# Altium schematic sheet NCP718_Breakout.SchDoc
size A4; SheetNumber: 1; SheetTotal: 1
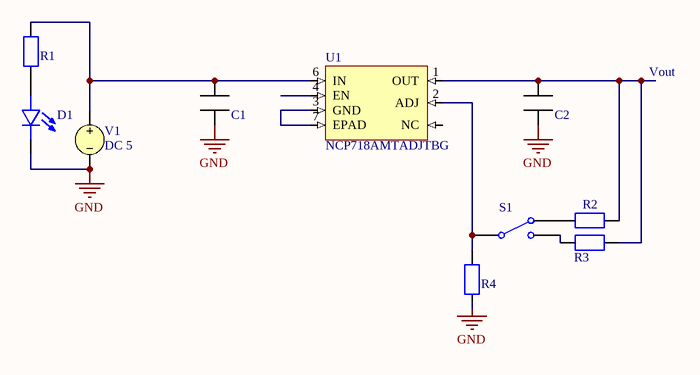
[diagram p0: NCP718_Breakout.SchDoc]

## Parts
C1  CAP_0805  [RES_0805]  (value not drawn)
C2  CAP_0805  [RES_0805]  (value not drawn)
D1  LED_0805  [RES_0805]  (value not drawn)
R1  RES_0805  [RES_0805]  (value not drawn)
R2  RES_0805  [RES_0805]  (value not drawn)
R3  RES_0805  [RES_0805]  (value not drawn)
R4  RES_0805  [RES_0805]  (value not drawn)
S1  Single-Pole, Double-Throw Switch  (value not drawn)
U1  NCP718AMTADJTBG  [FP-511BR-MFG]
V1  DC 5

## Nets
GND: C1.6 C2.6 D1.2(C) R4.1 V1.2
NetC1_7: C1.7 R1.1 U1.6(IN) V1.1
NetC2_7: C2.7 R2.2 R3.2 U1.1(OUT)
NetD1_1: D1.1(A) R1.2
NetR2_1: R2.1 S1.3
NetR3_1: R3.1 S1.2
NetR4_2: R4.2 S1.1 U1.2(ADJ)
NetU1_3: U1.3(GND) U1.7(EPAD)

Not connected (* = marked no-connect by the designer): U1 4(EN) 5(NC)

## Notes on the sheet
- Vout

## Library data of the parts
C1 C2 = CAP_0805: Generic CAP_0805
D1 = LED_0805: LED; SMD;; MF: Kingbright; MP: KP-1608SURCK; SnapEDA_Link: https://www.snapeda.com/parts/KP-1608SURCK/Kingbright/view-part/?ref=snap; Package: 0603 Kingbright; Value: *; Check_prices: https://www.snapeda.com/parts/KP-1608SURCK/Kingbright/view-part/?ref=eda
R1-R4 = RES_0805: Resistor SMD 0805 Generic; Manufacturer: *; Manufacturer Part Number: *; Tolerance: *; Package Size: *; LCSC Part Number: *
S1 = SPDT SW: nodeUP_closed: 1; Rclosed: 1m; Ropen: 1Meg; SimulationGenericComponent: True
U1 = NCP718AMTADJTBG: LDO Regulator, 300 mA, Wide Vin, Ultra-Low Iq Adjustable, Active Discharge, WDFN6; Manufacturer: onsemi; Accuracy: 2%; Dropout Voltage: 490mV; Max Junction Temperature (Tj): 125°C; Max Supply Voltage: 24V; Min Supply Voltage: 2.5V; Nominal Supply Current: 4µA; Number of Channels: 1; Output Current: 300mA; Supplier: DigiKey; RoHS: Compliant; Category: LDO Voltage Regulators; Stock: 7623; Pricing: 1=1,45, 10=0,891, 25=0,7444, 100=0,5783, 250=0,49668, 500=0,44646, 1000=0,40439, 3000=0,35003, 6000=0,34139, 9000=0,33706, 15000=0,33226, 21000=0,32946, 30000=0,32676 (USD); China RoHS: Compliant; Height: 800µm; Height - Seated (Max): 800µm; Length: 2mm; Lifecycle Status: Production; Manufacturer Lifecycle Status: ACTIVE; Max Operating Temperature: 150°C; Number of Circuits: 1; Number of Outputs: 1; Number of Terminals: 6; Output Type: Adjustable; REACH SVHC: Yes; Schedule B: 8542390000, 8542390000|8542390000|8542390000|8542390000|8542390000; Terminal Pitch: 650µm; Width: 2mm; ComponentLink1URL: https://datasheet.octopart.com:443/NCP718AMTADJTBG-onsemi-datasheet-180965627.pdf?src-supplier=IHS; ComponentLink1Description: https://datasheet.octopart.com:443/NCP718AMTADJTBG-onsemi-datasheet-180965627.pdf?src-supplier=IHS; ComponentLink2URL: https://datasheet.octopart.com:443/NCP718AMTADJTBG-onsemi-datasheet-166709100.pdf?src-supplier=Future+Electronics; ComponentLink2Description: https://datasheet.octopart.com:443/NCP718AMTADJTBG-onsemi-datasheet-166709100.pdf?src-supplier=Future+Electronics; ComponentLink3URL: https://datasheet.octopart.com:443/NCP718AMTADJTBG-ON-Semiconductor-datasheet-118180658.pdf?src-supplier=JRH+Electronics; ComponentLink3Description: https://datasheet.octopart.com:443/NCP718AMTADJTBG-ON-Semiconductor-datasheet-118180658.pdf?src-supplier=JRH+Electronics; ComponentLink4URL: https://datasheet.octopart.com:443/NCP718AMTADJTBG-ON-Semiconductor-datasheet-95952869.pdf?src-supplier=onsemi; ComponentLink4Description: https://datasheet.octopart.com:443/NCP718AMTADJTBG-ON-Semiconductor-datasheet-95952869.pdf?src-supplier=onsemi; ComponentLink5URL: https://datasheet.octopart.com:443/NCP718AMTADJTBG-onsemi-datasheet-164417801.pdf?src-supplier=Augswan; ComponentLink5Description: https://datasheet.octopart.com:443/NCP718AMTADJTBG-onsemi-datasheet-164417801.pdf?src-supplier=Augswan; ComponentLink6URL: http://sigma.octopart.com:80/150624016/rohs_statement/ON-Semiconductor-NCP718AMTADJTBG.pdf?src-supplier=Compliance+Statements; ComponentLink6Description: http://sigma.octopart.com:80/150624016/rohs_statement/ON-Semiconductor-NCP718AMTADJTBG.pdf?src-supplier=Compliance+Statements; ComponentLink7URL: http://sigma.octopart.com:80/reach_statement/ON-Semiconductor-company-79.pdf?src-supplier=Compliance+Statements; ComponentLink7Description: http://sigma.octopart.com:80/reach_statement/ON-Semiconductor-company-79.pdf?src-supplier=Compliance+Statements; ComponentLink8URL: https://octopart.com:443/opatz8j6/c1?t=1EmZ7aW7ozDgEKgzgDxmy6Ce9yc-wy2TtpZQSMBbWo6HCi9szzPxiq27GOJcZolI8qpv6zlbCSqWgqKmetWajKw_zvgToOZAV9dje8hGBN3zAZWTdLa29F6_MwIwlQNR0qrKrKh2N2c7ATDpXHU05XnhWBKGeUccCUEC4qhDUvl-DisyYVQsairzLsAwCWg26GeFc0g7k-DKicWhZcgG8WwfY1o8yuJOgsOSWH7vGSKKkSi6l5wAWlG-YvUPUhRZh_VS4-ljLfEH9xLWXI7eAC8XC5-m8JFm4VZZp5W3jRgxGg8KN4R4Z3ykaPlSDEBiwobiPFF5QrhPinNcp0GNNbKeyOnMV4RdCKbR8YEKGX931t8&src-supplier=Compliance+Statements; ComponentLink8Description: https://octopart.com:443/opatz8j6/c1?t=1EmZ7aW7ozDgEKgzgDxmy6Ce9yc-wy2TtpZQSMBbWo6HCi9szzPxiq27GOJcZolI8qpv6zlbCSqWgqKmetWajKw_zvgToOZAV9dje8hGBN3zAZWTdLa29F6_MwIwlQNR0qrKrKh2N2c7ATDpXHU05XnhWBKGeUccCUEC4qhDUvl-DisyYVQsairzLsAwCWg26GeFc0g7k-DKicWhZcgG8WwfY1o8yuJOgsOSWH7vGSKKkSi6l5wAWlG-YvUPUhRZh_VS4-ljLfEH9xLWXI7eAC8XC5-m8JFm4VZZp5W3jRgxGg8KN4R4Z3ykaPlSDEBiwobiPFF5QrhPinNcp0GNNbKeyOnMV4RdCKbR8YEKGX931t8&src-supplier=Compliance+Statements; ComponentLink9URL: https://octopart.com:443/opatz8j6/c1?t=_F9nwvh9A146v8vnwpt6Stt88nf1nqO0GTPwlr1t7m-FlAhLbOF_cVGyLivZvGhAweeOuH73KM5N6H6InrHDGk-wcJBSRav1hel2W23246D4nAncp9jOZvyRce9z1NE1l6JnLT2YbEU9iI_tnABLapf6MX6AOc8B6Qt0kj3bJgfVHILUPNwn0VL14asw8zdrDNhJH81Qzkv9AW0WS46LD5uOKoV8TFFRRptnKck9iextg0-nG2tW6ZOnDJTZjx8CeCb1voCfBZTb64aAmaXl2pFokxg28SAm0MiRhqR0sz3sOkLzNoGn9onMHkuSAUFnfyNRWrtatyYh0uBQK_d5XO7LBXmJosECi2VzZ7hgoGY1ag&src-supplier=Compliance+Statements; ComponentLink9Description: https://octopart.com:443/opatz8j6/c1?t=_F9nwvh9A146v8vnwpt6Stt88nf1nqO0GTPwlr1t7m-FlAhLbOF_cVGyLivZvGhAweeOuH73KM5N6H6InrHDGk-wcJBSRav1hel2W23246D4nAncp9jOZvyRce9z1NE1l6JnLT2YbEU9iI_tnABLapf6MX6AOc8B6Qt0kj3bJgfVHILUPNwn0VL14asw8zdrDNhJH81Qzkv9AW0WS46LD5uOKoV8TFFRRptnKck9iextg0-nG2tW6ZOnDJTZjx8CeCb1voCfBZTb64aAmaXl2pFokxg28SAm0MiRhqR0sz3sOkLzNoGn9onMHkuSAUFnfyNRWrtatyYh0uBQK_d5XO7LBXmJosECi2VzZ7hgoGY1ag&src-supplier=Compliance+Statements; Supplier Part Number: NCP718AMTADJTBGOSCT-ND
V1 = VSRC: Voltage Source; Note: PCB Footprint - Not required; AC Magnitude: 1; AC Phase: 0; Value: 5; Published: 8-Jun-2000; LatestRevisionDate: 17-Jul-2002; LatestRevisionNote: Re-released for DXP Platform.; PackageReference: Not Applicable; Publisher: Altium Limited